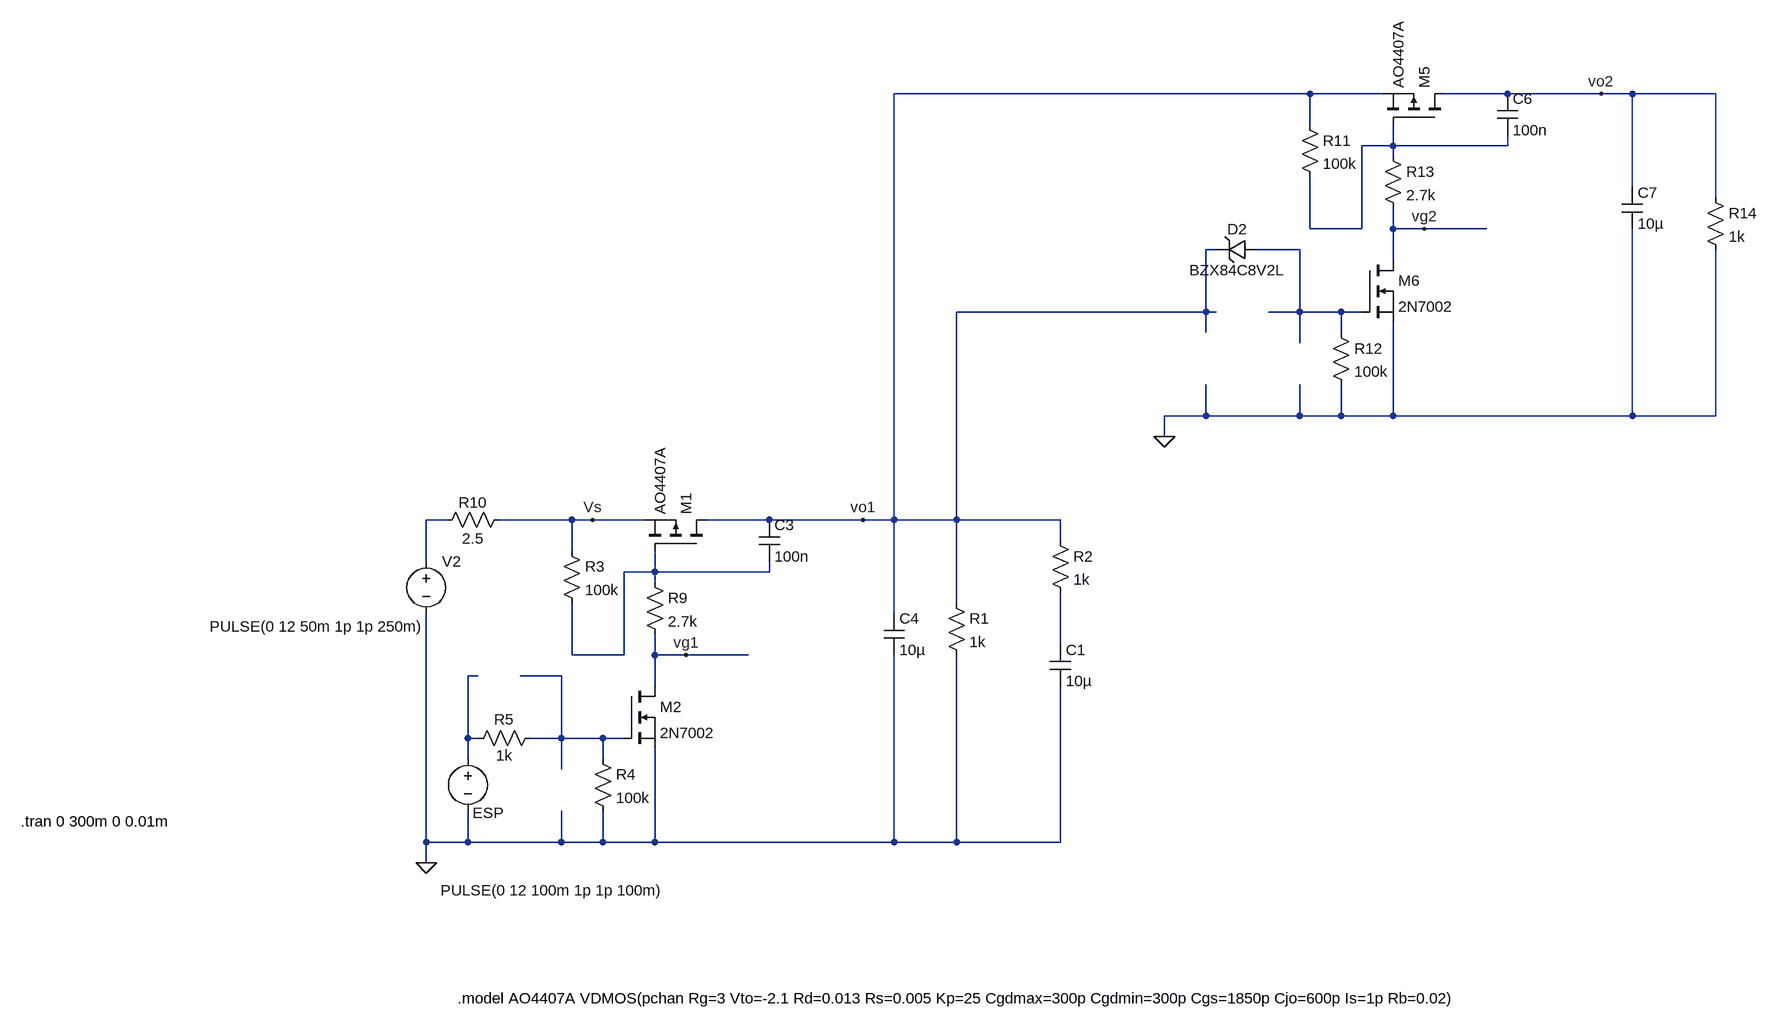
[diagram p0: schematic llave analogica.asc]
llave analogica.asc, the LTspice schematic file:
Version 4
SHEET 1 2248 752
WIRE 1136 -656 496 -656
WIRE 1248 -656 1136 -656
WIRE 1440 -656 1344 -656
WIRE 1584 -656 1440 -656
WIRE 1632 -656 1584 -656
WIRE 1760 -656 1632 -656
WIRE 1136 -608 1136 -656
WIRE 1264 -576 1264 -608
WIRE 1264 -576 1216 -576
WIRE 1440 -576 1440 -592
WIRE 1440 -576 1264 -576
WIRE 1264 -560 1264 -576
WIRE 1632 -512 1632 -656
WIRE 1760 -496 1760 -656
WIRE 1136 -448 1136 -528
WIRE 1216 -448 1216 -576
WIRE 1216 -448 1136 -448
WIRE 1264 -448 1264 -480
WIRE 1312 -448 1264 -448
WIRE 1408 -448 1312 -448
WIRE 992 -416 976 -416
WIRE 1120 -416 1056 -416
WIRE 1264 -400 1264 -448
WIRE 976 -320 976 -416
WIRE 976 -320 592 -320
WIRE 992 -320 976 -320
WIRE 1120 -320 1120 -416
WIRE 1120 -320 1072 -320
WIRE 1184 -320 1120 -320
WIRE 1216 -320 1184 -320
WIRE 976 -288 976 -320
WIRE 1184 -288 1184 -320
WIRE 1120 -272 1120 -320
WIRE 976 -160 976 -208
WIRE 976 -160 912 -160
WIRE 1120 -160 1120 -208
WIRE 1120 -160 976 -160
WIRE 1184 -160 1184 -208
WIRE 1184 -160 1120 -160
WIRE 1264 -160 1264 -304
WIRE 1264 -160 1184 -160
WIRE 1632 -160 1632 -448
WIRE 1632 -160 1264 -160
WIRE 1760 -160 1760 -416
WIRE 1760 -160 1632 -160
WIRE 912 -128 912 -160
WIRE -192 0 -224 0
WIRE 0 0 -112 0
WIRE 32 0 0 0
WIRE 112 0 32 0
WIRE 304 0 208 0
WIRE 448 0 304 0
WIRE 496 0 496 -656
WIRE 496 0 448 0
WIRE 592 0 592 -320
WIRE 592 0 496 0
WIRE 752 0 592 0
WIRE 752 32 752 0
WIRE 0 48 0 0
WIRE -224 64 -224 0
WIRE 128 80 128 48
WIRE 128 80 80 80
WIRE 304 80 304 64
WIRE 304 80 128 80
WIRE 128 96 128 80
WIRE 592 128 592 0
WIRE 496 144 496 0
WIRE 752 192 752 112
WIRE 0 208 0 128
WIRE 80 208 80 80
WIRE 80 208 0 208
WIRE 128 208 128 176
WIRE 176 208 128 208
WIRE 272 208 176 208
WIRE -144 240 -160 240
WIRE -16 240 -80 240
WIRE 128 256 128 208
WIRE -160 336 -160 240
WIRE -144 336 -160 336
WIRE -16 336 -16 240
WIRE -16 336 -64 336
WIRE 48 336 -16 336
WIRE 80 336 48 336
WIRE -160 368 -160 336
WIRE 48 368 48 336
WIRE -16 384 -16 336
WIRE -224 496 -224 144
WIRE -160 496 -160 448
WIRE -160 496 -224 496
WIRE -16 496 -16 448
WIRE -16 496 -160 496
WIRE 48 496 48 448
WIRE 48 496 -16 496
WIRE 128 496 128 352
WIRE 128 496 48 496
WIRE 496 496 496 208
WIRE 496 496 128 496
WIRE 592 496 592 208
WIRE 592 496 496 496
WIRE 752 496 752 256
WIRE 752 496 592 496
WIRE -224 528 -224 496
FLAG -224 528 0
FLAG 448 0 vo1
FLAG 176 208 vg1
FLAG 912 -128 0
FLAG 1584 -656 vo2
FLAG 1312 -448 vg2
FLAG 32 0 Vs
SYMBOL pmos 208 48 M270
SYMATTR InstName M1
SYMATTR Value AO4407A
SYMBOL voltage -160 352 R0
WINDOW 3 -42 218 Left 2
WINDOW 123 0 0 Left 0
WINDOW 39 0 0 Left 0
WINDOW 0 7 99 Left 2
SYMATTR Value PULSE(0 12 100m 1p 1p 100m)
SYMATTR InstName ESP
SYMBOL voltage -224 48 R0
WINDOW 123 0 0 Left 0
WINDOW 39 0 0 Left 0
WINDOW 3 -333 116 Left 2
SYMATTR Value PULSE(0 12 50m 1p 1p 250m)
SYMATTR InstName V2
SYMBOL res 576 112 R0
SYMATTR InstName R1
SYMATTR Value 1k
SYMBOL res 736 16 R0
SYMATTR InstName R2
SYMATTR Value 1k
SYMBOL cap 736 192 R0
SYMATTR InstName C1
SYMATTR Value 10µ
SYMBOL nmos 80 256 R0
SYMATTR InstName M2
SYMATTR Value 2N7002
SYMBOL res -16 32 R0
SYMATTR InstName R3
SYMATTR Value 100k
SYMBOL res 32 352 R0
SYMATTR InstName R4
SYMATTR Value 100k
SYMBOL res 112 80 R0
SYMATTR InstName R9
SYMATTR Value 2.7k
SYMBOL cap 288 0 R0
SYMATTR InstName C3
SYMATTR Value 100n
SYMATTR SpiceLine Rser=1
SYMBOL cap 480 144 R0
SYMATTR InstName C4
SYMATTR Value 10µ
SYMATTR SpiceLine Rser=5
SYMBOL res -208 16 R270
WINDOW 0 27 56 VTop 2
WINDOW 3 3 56 VBottom 2
SYMATTR InstName R10
SYMATTR Value 2.5
SYMBOL pmos 1344 -608 M270
SYMATTR InstName M5
SYMATTR Value AO4407A
SYMBOL nmos 1216 -400 R0
SYMATTR InstName M6
SYMATTR Value 2N7002
SYMBOL res 1120 -624 R0
SYMATTR InstName R11
SYMATTR Value 100k
SYMBOL res 1168 -304 R0
SYMATTR InstName R12
SYMATTR Value 100k
SYMBOL res 1248 -576 R0
SYMATTR InstName R13
SYMATTR Value 2.7k
SYMBOL cap 1424 -656 R0
SYMATTR InstName C6
SYMATTR Value 100n
SYMATTR SpiceLine Rser=1
SYMBOL cap 1616 -512 R0
SYMATTR InstName C7
SYMATTR Value 10µ
SYMATTR SpiceLine Rser=5
SYMBOL zener 1056 -432 R90
WINDOW 0 0 32 VBottom 2
WINDOW 3 32 32 VTop 2
SYMATTR InstName D2
SYMATTR Value BZX84C8V2L
SYMATTR Description Diode
SYMATTR Type diode
SYMBOL res 1744 -512 R0
SYMATTR InstName R14
SYMATTR Value 1k
SYMBOL res -48 320 R90
WINDOW 0 3 56 VBottom 2
WINDOW 3 27 56 VTop 2
SYMATTR InstName R5
SYMATTR Value 1k
TEXT -848 464 Left 2 !.tran 0 300m 0 0.01m
TEXT -176 736 Left 2 !.model AO4407A VDMOS(pchan Rg=3 Vto=-2.1 Rd=0.013 Rs=0.005 Kp=25 Cgdmax=300p Cgdmin=300p Cgs=1850p Cjo=600p Is=1p Rb=0.02)

The netlist it stands for:
* llave analogica.asc
M1 vo1 N004 Vs Vs AO4407A
V§ESP N006 0 PULSE(0 12 100m 1p 1p 100m)
V2 N003 0 PULSE(0 12 50m 1p 1p 250m)
R1 vo1 0 1k
R2 vo1 N005 1k
C1 N005 0 10µ
M2 vg1 N007 0 0 2N7002
R3 Vs N004 100k
R4 N007 0 100k
R9 N004 vg1 2.7k
C3 vo1 N004 100n Rser=1
C4 vo1 0 10µ Rser=5
R10 N003 Vs 2.5
M5 vo2 N001 vo1 vo1 AO4407A
M6 vg2 N002 0 0 2N7002
R11 vo1 N001 100k
R12 N002 0 100k
R13 N001 vg2 2.7k
C6 vo2 N001 100n Rser=1
C7 vo2 0 10µ Rser=5
D2 N002 vo1 BZX84C8V2L
R14 vo2 0 1k
R5 N007 N006 1k
.model D D
.lib standard.dio
.model NMOS NMOS
.model PMOS PMOS
.lib standard.mos
.tran 0 300m 0 0.01m
.model AO4407A VDMOS(pchan Rg=3 Vto=-2.1 Rd=0.013 Rs=0.005 Kp=25 Cgdmax=300p Cgdmin=300p Cgs=1850p Cjo=600p Is=1p Rb=0.02)
.backanno
.end

* Results of the author's LTspice run, read from the files saved beside the schematic
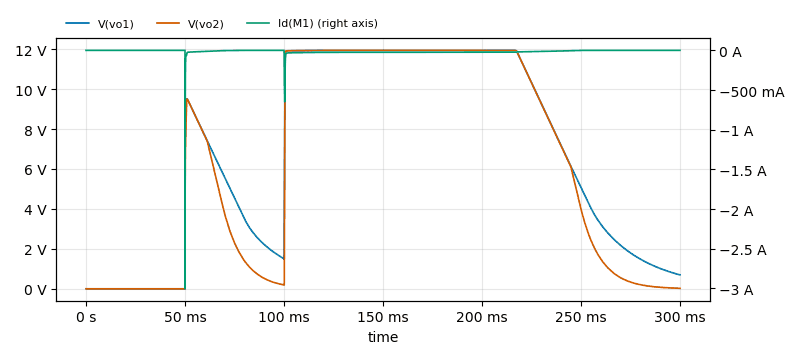
[diagram p1: Transient Analysis of llave analogica.asc, plotted from the saved traces]
* Transient Analysis, 1 run:
*   V(vo1): min 0 V, max 11.94 V, average 6.755 V, rms 8.363 V, last 696.5 mV
*   V(vo2): min 0 V, max 11.94 V, average 6.305 V, rms 8.238 V, last 25.93 mV
*   Id(M1): min -3.006 A, max 11.8 µA, average -13.19 mA, rms 33.63 mA, last 0 A